# Altium schematic sheet iMX53 Base Board Project.SchDoc
size A3; PageSetup: Record=PageOptions|CenterHorizontal=True|CenterVertical=True|PrintScale=1.07|XCorrection=1.00|YCorrection=1.00|PrintKind=1|BorderSize=5000000|LeftOffset=0|BottomOffset=0|Orientation=2|PaperLength=1000|PaperWidth=1000|Scale=100|PaperSource=7|PrintQuality=600|MediaType=1|DitherType=10|PaperKind=A3|PrintScaleMode=1; CompanyName: FPT-FTI copporation; Address1: FPT Building Duy Tan; Address2: Floor 4,; DocumentNumber: 12; SheetNumber: 12; SheetTotal: 13; NameAuthor: Angle Vu
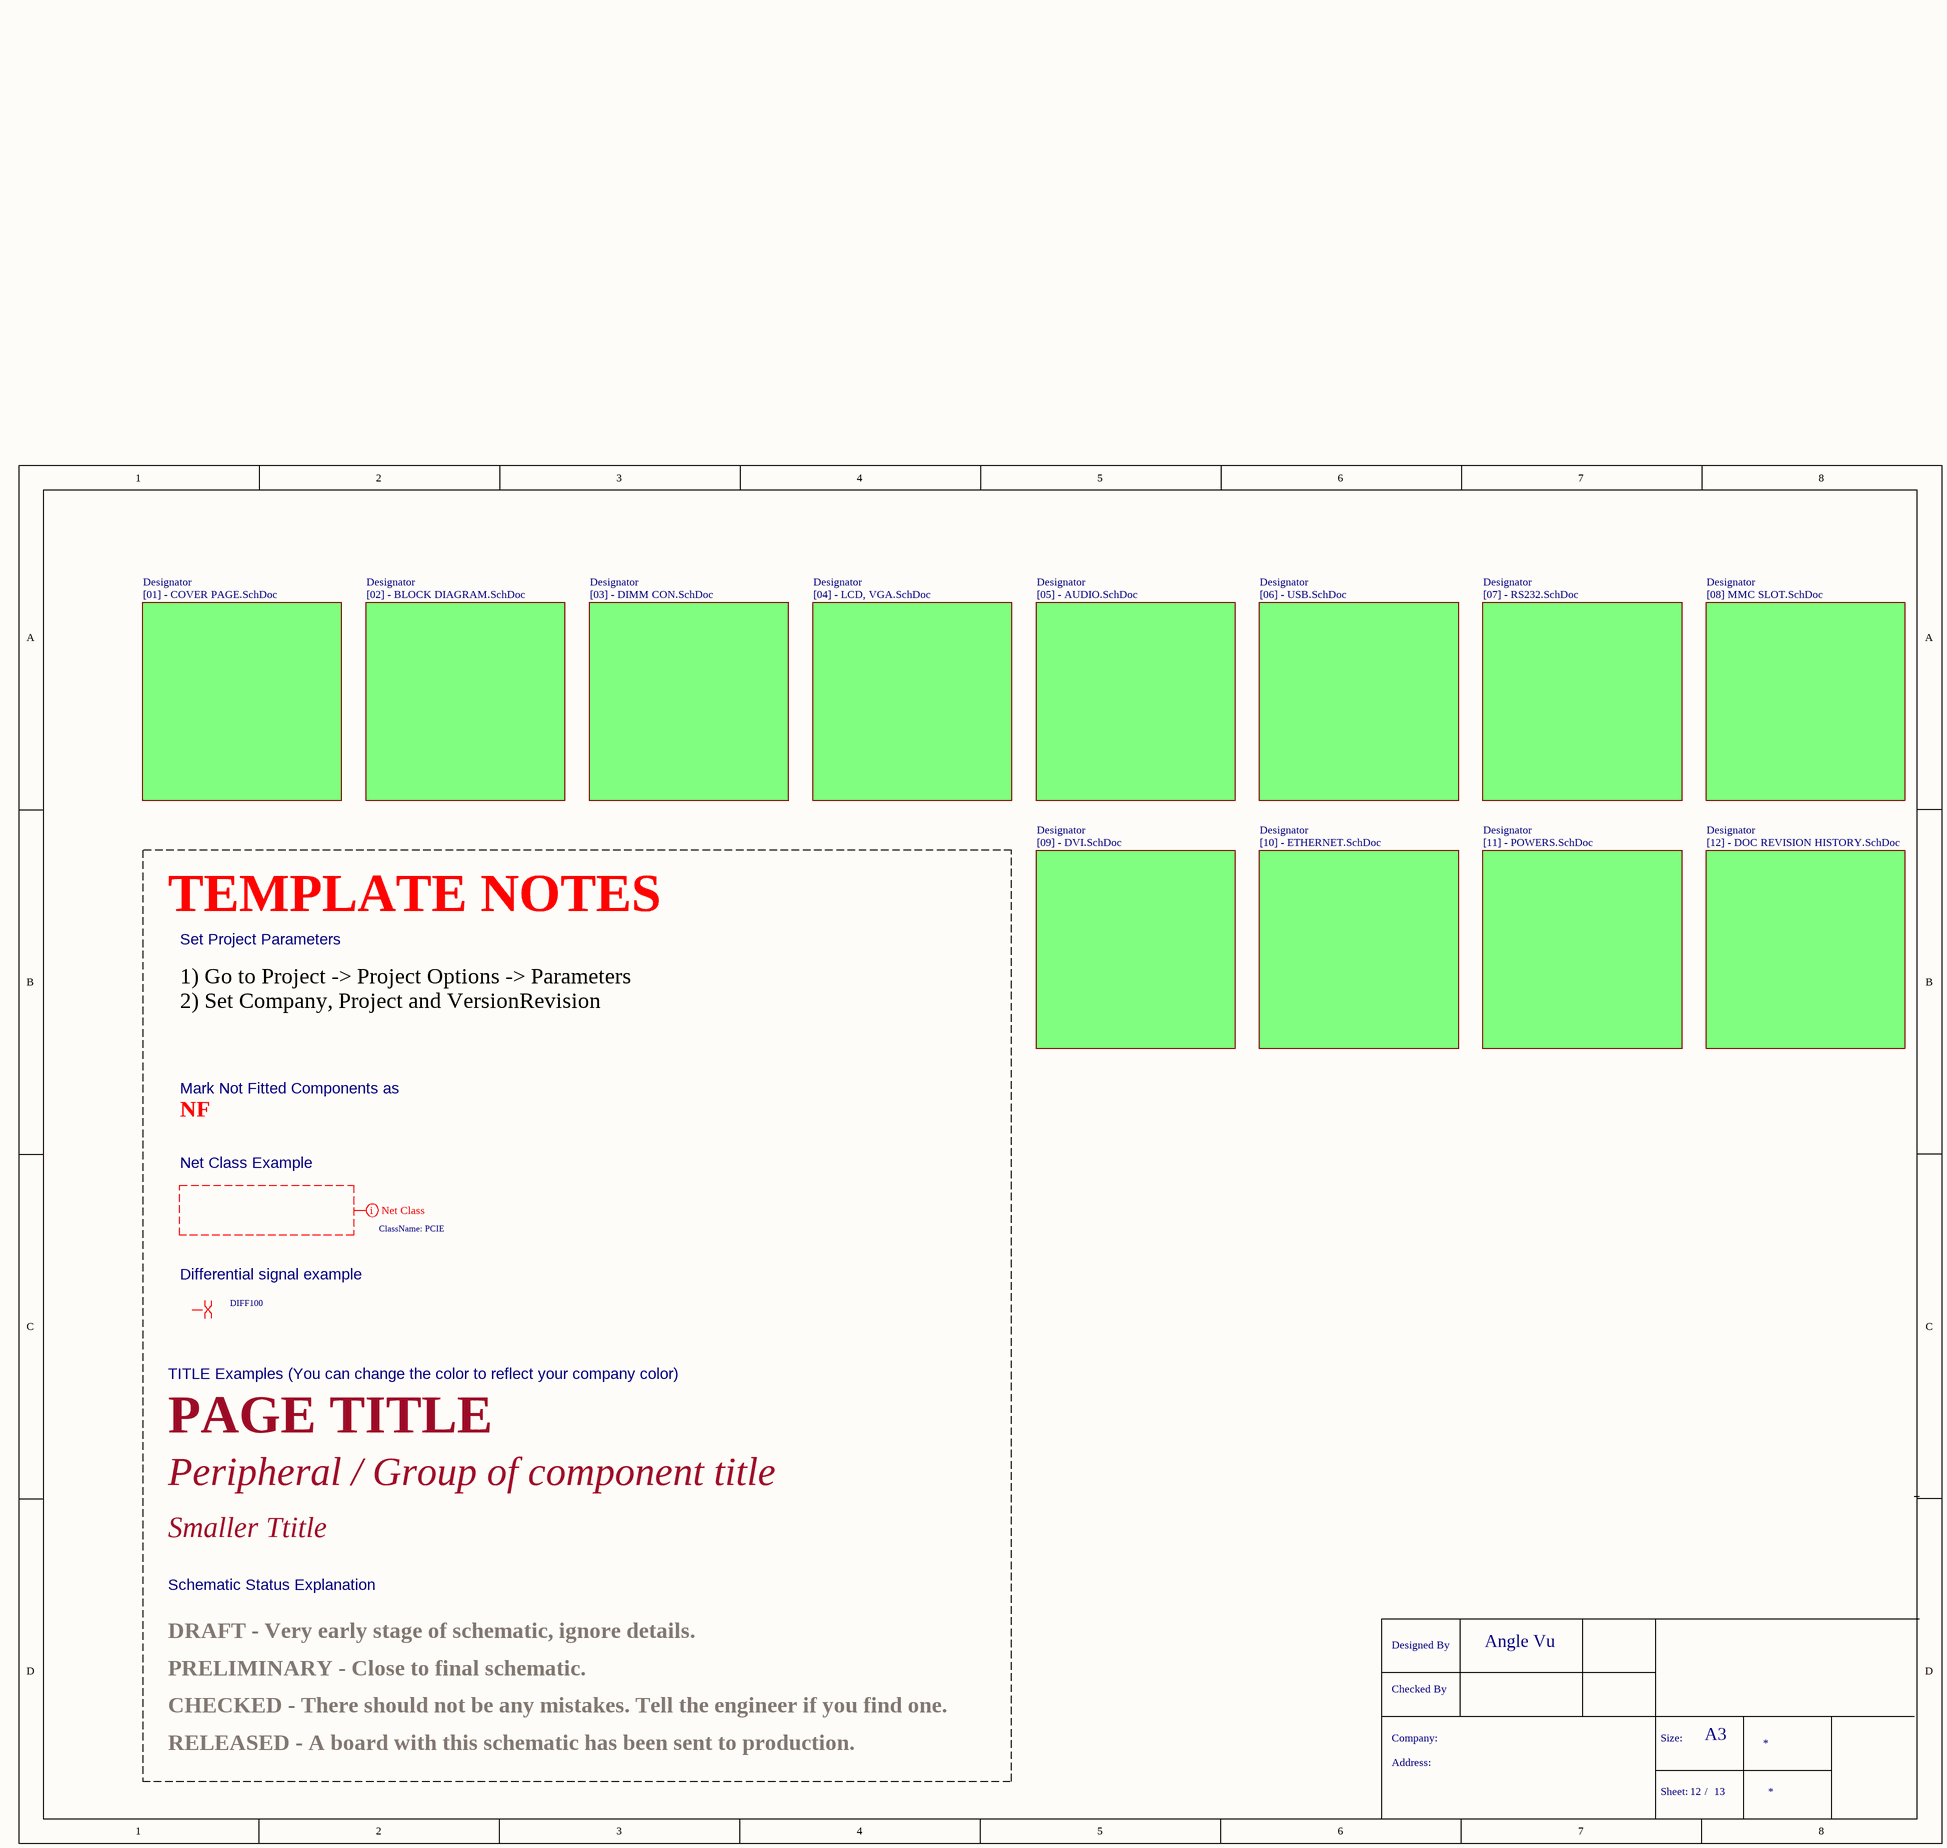
[diagram p0: iMX53 Base Board Project.SchDoc]

## Sub-sheets
Designator = [01] - COVER PAGE.SchDoc: no entries
Designator = [02] - BLOCK DIAGRAM.SchDoc: no entries
Designator = [03] - DIMM CON.SchDoc: no entries
Designator = [04] - LCD, VGA.SchDoc: no entries
Designator = [05] - AUDIO.SchDoc: no entries
Designator = [06] - USB.SchDoc: no entries
Designator = [07] - RS232.SchDoc: no entries
Designator = [08] MMC SLOT.SchDoc: no entries
Designator = [09] - DVI.SchDoc: no entries
Designator = [10] - ETHERNET.SchDoc: no entries
Designator = [11] - POWERS.SchDoc: no entries
Designator = [12] - DOC REVISION HISTORY.SchDoc: no entries

## Layout directives
net class PCIE: (no net found under the mark)
differential pair; net class DIFF100: (no net found under the mark)

## Notes on the sheet
- TEMPLATE NOTES
- Set Project Parameters
- 1) Go to Project -> Project Options -> Parameters
  2) Set Company, Project and VersionRevision
- NF
- Mark Not Fitted Components as
- Net Class Example
- Differential signal example
- TITLE Examples (You can change the color to reflect your company color)
- PAGE TITLE
- Peripheral / Group of component title
- Smaller Ttitle
- Schematic Status Explanation
- PRELIMINARY - Close to final schematic.
- DRAFT - Very early stage of schematic, ignore details.
- CHECKED - There should not be any mistakes. Tell the engineer if you find one.
- RELEASED - A board with this schematic has been sent to production.
- Designed By
- Checked By
- Company:
- Size:
- A3
- Address:
- Sheet:
- /